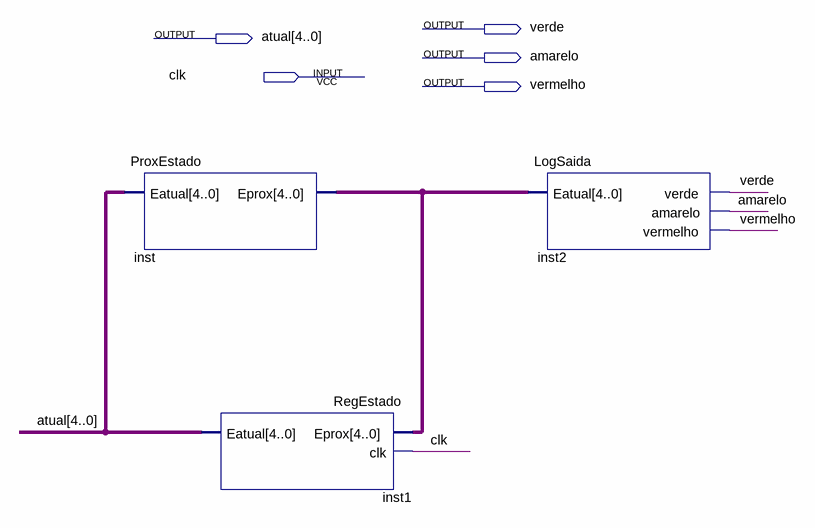
[diagram p0: schematic sheet]
// Quartus schematic LAB08.bdf as structural Verilog: 3 symbols, 5 pins
module LAB08 (
  input  clk,
  output verde,
  output [4:0] atual,
  output amarelo,
  output vermelho
);

  wire [4:0] inst_eprox;

  ProxEstado inst (.Eatual(atual), .Eprox(inst_eprox));
  RegEstado inst1 (.Eprox(inst_eprox), .clk(clk), .Eatual(atual));
  LogSaida inst2 (.Eatual(inst_eprox), .verde(verde), .amarelo(amarelo), .vermelho(vermelho));
endmodule
